# Altium schematic sheet PMU.SchDoc: 6s Lipo Protection Board
size A3; Author: Yue Wang; CompanyName: UoS; DrawnBy: Yue Wang; Engineer: Yue Wang; Organization: UoS; SheetNumber: 1; SheetTotal: 2
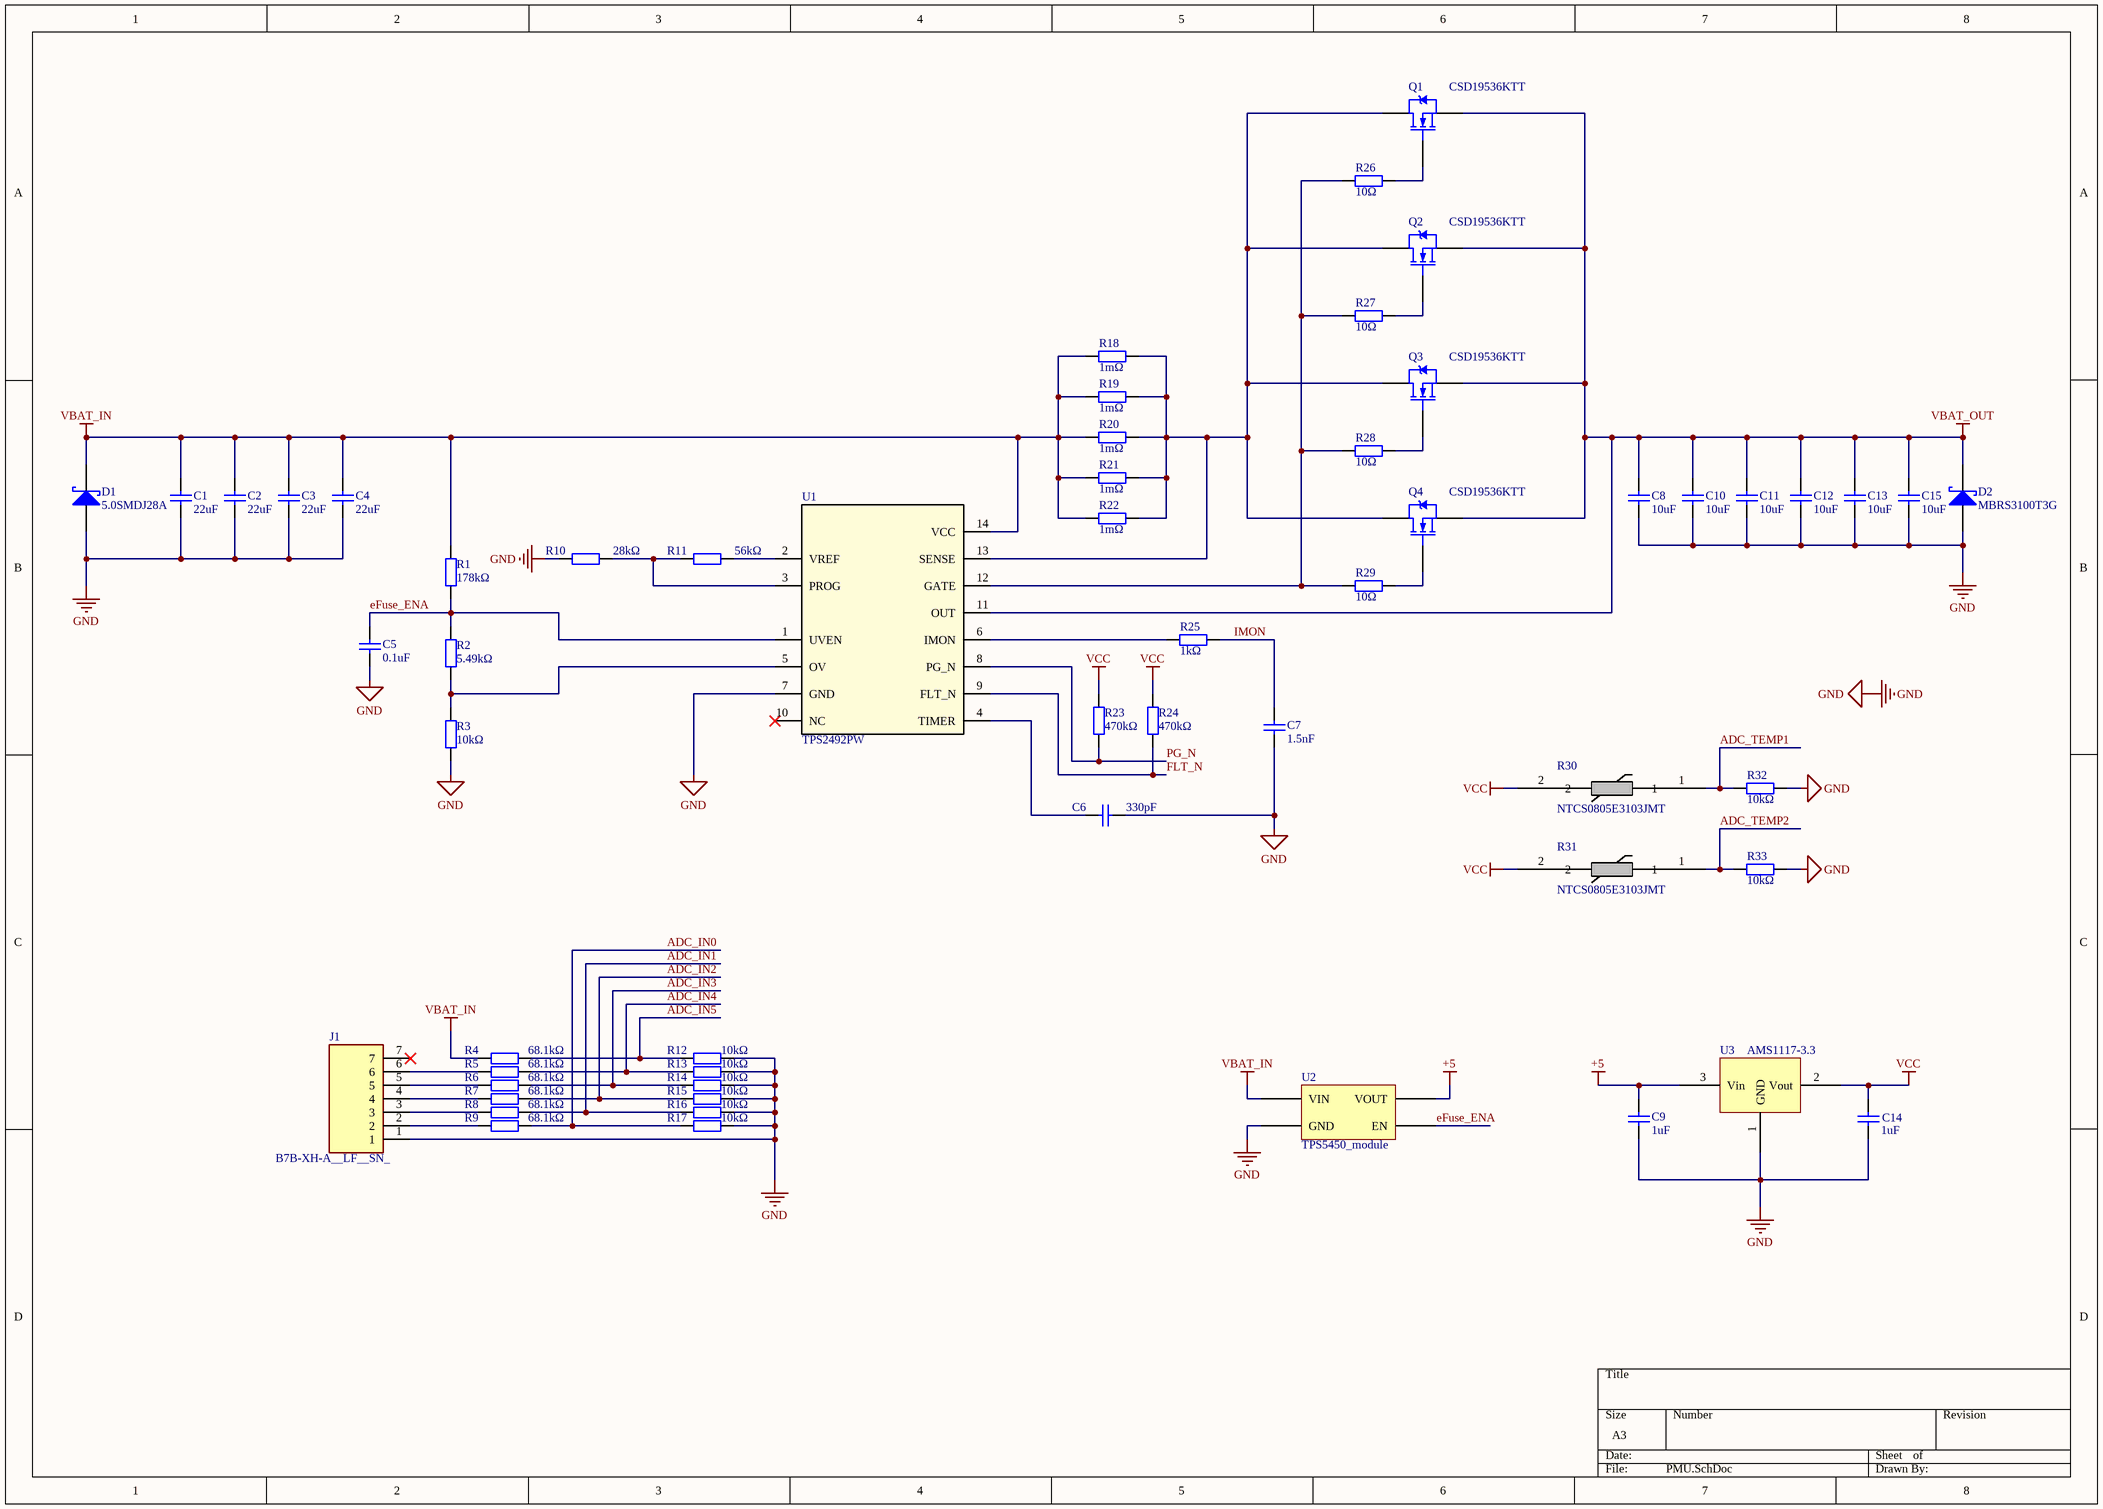
[diagram p0: PMU.SchDoc]

## Parts
C1  22uF  [C1210]
C2  22uF  [C1210]
C3  22uF  [C1210]
C4  22uF  [C1210]
C5  0.1uF  [C0603]
C6  330pF  [C0603]
C7  1.5nF  [C0603]
C8  10uF  [C1210]
C9  1uF  [C0603]
C10  10uF  [C1210]
C11  10uF  [C1210]
C12  10uF  [C1210]
C13  10uF  [C1210]
C14  1uF  [C0603]
C15  10uF  [C1210]
D1  5.0SMDJ28A  [SMA(DO-214AC)]
D2  MBRS3100T3G  [SMA(DO-214AC)]
J1  B7B-XH-A__LF__SN_  [SHDR7W64P0X250_1X7_1990X575X700P]
Q1  CSD19536KTT  [KTT0002A]
Q2  CSD19536KTT  [KTT0002A]
Q3  CSD19536KTT  [KTT0002A]
Q4  CSD19536KTT  [KTT0002A]
R1  178kΩ  [R0603]
R2  5.49kΩ  [R0603]
R3  10kΩ  [R0603]
R4  68.1kΩ  [R0603]
R5  68.1kΩ  [R0603]
R6  68.1kΩ  [R0603]
R7  68.1kΩ  [R0603]
R8  68.1kΩ  [R0603]
R9  68.1kΩ  [R0603]
R10  28kΩ  [R0603]
R11  56kΩ  [R0603]
R12  10kΩ  [R0603]
R13  10kΩ  [R0603]
R14  10kΩ  [R0603]
R15  10kΩ  [R0603]
R16  10kΩ  [R0603]
R17  10kΩ  [R0603]
R18  1mΩ  [2512_R]
R19  1mΩ  [2512_R]
R20  1mΩ  [2512_R]
R21  1mΩ  [2512_R]
R22  1mΩ  [2512_R]
R23  470kΩ  [R0603]
R24  470kΩ  [R0603]
R25  1kΩ  [R0603]
R26  10Ω  [R0603]
R27  10Ω  [R0603]
R28  10Ω  [R0603]
R29  10Ω  [R0603]
R30  NTCS0805E3103JMT  [NTCS0805_VIS]
R31  NTCS0805E3103JMT  [NTCS0805_VIS]
R32  10kΩ  [R0603]
R33  10kΩ  [R0603]
U1  TPS2492PW  [PW0014A_N]
U2  TPS5450_module  [TPS5450_module]
U3  AMS1117-3.3  [SOT-223]

## Nets
+5: C9.2 U2.4(VOUT) U3.3(Vin)
GND: C1.1 C2.1 C3.1 C4.1 C5.1 C6.1 C7.1 C8.1 C9.1 C10.1 C11.1 C12.1 C13.1 C14.1 C15.1 D1.1(A) D2.1(A) J1.1 R3.1 R10.1 R12.1 R13.1 R14.1 R15.1 R16.1 R17.1 R32.2 R33.2 U1.7(GND) U2.2(GND) U3.1(GND)
VBAT_IN: C1.2 C2.2 C3.2 C4.2 D1.2(K) R1.2 R4.2 R18.1 R19.1 R20.1 R21.1 R22.1 U1.14(VCC) U2.1(VIN)
VBAT_OUT: C8.2 C10.2 C11.2 C12.2 C13.2 C15.2 D2.2(K) Q1.3(S) Q2.3(S) Q3.3(S) Q4.3(S) U1.11(OUT)
VCC: C14.2 R23.1 R24.1 R30.2 R31.2 U3.2(Vout)
ADC_IN0: R9.1 R17.2
ADC_IN1: R8.1 R16.2
ADC_IN2: R7.1 R15.2
ADC_IN3: R6.1 R14.2
ADC_IN4: R5.1 R13.2
ADC_IN5: R4.1 R12.2
ADC_TEMP1: R30.1 R32.1
ADC_TEMP2: R31.1 R33.1
eFuse_ENA: C5.2 R1.1 R2.2 U1.1(UVEN) U2.3(EN)
FLT_N: R24.2 U1.9(FLT_N)
IMON: C7.2 R25.1
PG_N: R23.2 U1.8(PG_N)
NetC6_2: C6.2 U1.4(TIMER)
NetJ1_2: J1.2 R9.2
NetJ1_3: J1.3 R8.2
NetJ1_4: J1.4 R7.2
NetJ1_5: J1.5 R6.2
NetJ1_6: J1.6 R5.2
NetQ1_1: Q1.1(G) R26.1
NetQ1_2: Q1.2(D) Q2.2(D) Q3.2(D) Q4.2(D) R18.2 R19.2 R20.2 R21.2 R22.2 U1.13(SENSE)
NetQ2_1: Q2.1(G) R27.1
NetQ3_1: Q3.1(G) R28.1
NetQ4_1: Q4.1(G) R29.1
NetR2_1: R2.1 R3.2 U1.5(OV)
NetR10_2: R10.2 R11.1 U1.3(PROG)
NetR11_2: R11.2 U1.2(VREF)
NetR25_2: R25.2 U1.6(IMON)
NetR26_2: R26.2 R27.2 R28.2 R29.2 U1.12(GATE)

Not connected (* = marked no-connect by the designer): J1 7*; U1 10(NC)*

## Library data of the parts
C1-C4 C8-C15 = Capacitor: VJ1210Y104MXCAT
C5-C7 = Capacitor
D1 = Diode_Schottky: pin to pad: 1>2 2>1
D2 = Diode_Schottky: Schottky Diodes & Rectifiers 3A 100V; pin to pad: 1>2 2>1
J1 = B7B-XH-A__LF__SN_: Connector; Manufacturer_Name: JST (JAPAN SOLDERLESS TERMINALS); Manufacturer_Part_Number: B7B-XH-A (LF)(SN); Datasheet Link: https://www.jst.com/wp-content/uploads/2021/01/eXH-new.pdf; Height: 7mm; Arrow Part Number: B7B-XH-A (LF)(SN); Arrow Price/Stock: https://www.arrow.com/en/products/b7b-xh-a-lf-sn/jst-manufacturing
Q1-Q4 = NMOSFET: 100-V N-Channel NexFET™ Power MOSFET
R1-R17 R23-R29 R32 R33 = Resistor
R18-R22 = Resistor: CHSA2512R0010F
R30 R31 = CMP-02404-000004-2: THERMISTOR NTC 10KOHM 3570K 0805; NexarPartId: 39723061; Power Rating: 210mW; Tolerance: 5%; Resistance: 10kΩ; Accuracy: 3%; Lead Free: Lead Free; Termination: SMD/SMT; Mount: Surface Mount; Max Operating Temperature: 150°C; REACH SVHC: Unknown; Case/Package: 0805; Number of Pins: 2; Radiation Hardening: No; Packaging: Cut Tape (CT); Height: 950µm; Schedule B: 8533400080, 8533400080; Depth: 1.25mm; Length: 2mm; Min Operating Temperature: -40°C; Contact Plating: Tin; RoHS: Compliant; Max Power Dissipation: 210mW; Case Code (Imperial): 0805; Case Code (Metric): 2012
U1 = TPS2492PW: The TPS2492 and TPS2493 are easy-to-use, positive high voltage, 14-pin Hotswap Controllers that safely drive an external N-channel FET to control load current. The programmable power foldback protection ensures that the external FET operates inside its safe operating area (SOA) during overload conditions by controlling of power dissipation. The programmable current limit and fault timer ensure the supply, external FET, and load are not harmed by overcurrent. Features include inrush current limiting, controlled load turn-on, interfacing to down-stream DC-to-DC converters, and power feed protection. / The analog current monitor output provides a signal ready for sampling with an external A/D converter. / Additional features include programmable overvoltage and undervoltage shutdown, power-good for coordinating loads with inrush, and a fault indicator to indicate an over-current shutdown.
U2 = TPS5450_module: https://item.taobao.com/item.htm?id=678523742086&spm=a1z0d.6639537&sku_properties=1627207:1665065280
U3 = AMS1117-3.3: C347222